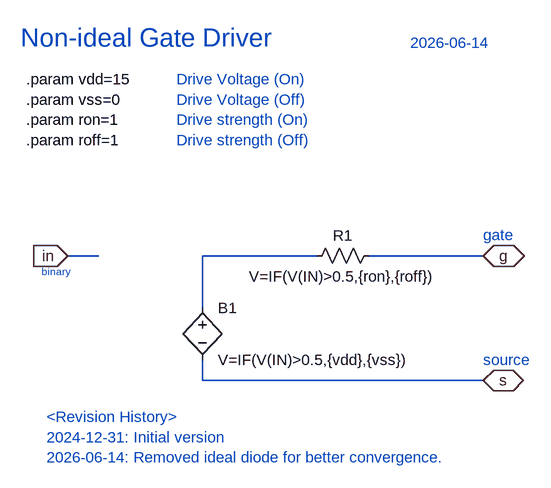
[diagram p0: schematic GD.asc]
GD.asc, the LTspice schematic file:
Version 4.1
SHEET 1 1232 680
WIRE 64 48 16 48
WIRE 400 48 224 48
WIRE 656 48 480 48
WIRE 224 128 224 48
WIRE 224 240 224 208
WIRE 656 240 224 240
FLAG 16 48 in
IOPIN 16 48 In
FLAG 656 48 g
IOPIN 656 48 BiDir
FLAG 656 240 s
IOPIN 656 240 BiDir
SYMBOL bv 224 112 R0
SYMATTR InstName B1
SYMATTR Value V=IF(V(IN)>0.5,{vdd},{vss})
SYMBOL res 496 32 R90
WINDOW 0 0 56 VBottom 2
WINDOW 3 32 56 VTop 2
SYMATTR InstName R1
SYMATTR Value V=IF(V(IN)>0.5,{ron},{roff})
TEXT -48 -224 Left 2 !.param vdd=15\n.param vss=0\n.param ron=1\n.param roff=1
TEXT -56 -288 Left 4 ;Non-ideal Gate Driver
TEXT 184 -224 Left 2 ;Drive Voltage (On)\nDrive Voltage (Off)\nDrive strength (On)\nDrive strength (Off)
TEXT -24 72 Left 1 ;binary
TEXT 656 16 Left 2 ;gate
TEXT 656 208 Left 2 ;source
TEXT 544 -280 Left 2 ;2026-06-14
TEXT -16 296 Left 2 ;<Revision History>\n2024-12-31: Initial version\n2026-06-14: Removed ideal diode for better convergence.

The netlist it stands for:
* GD.asc
B1 N001 s V=IF(V(IN)>0.5,{vdd},{vss})
R1 g N001 V=IF(V(IN)>0.5,{ron},{roff})
.param vdd=15
.param vss=0
.param ron=1
.param roff=1
* Non-ideal Gate Driver
* Drive Voltage (On)
* Drive Voltage (Off)
* Drive strength (On)
* Drive strength (Off)
* binary
* gate
* source
* 2026-06-14
* <Revision History>
* 2024-12-31: Initial version
* 2026-06-14: Removed ideal diode for better convergence.
.backanno
.end